# EAGLE design hw3s (EAGLE 8.6.0)
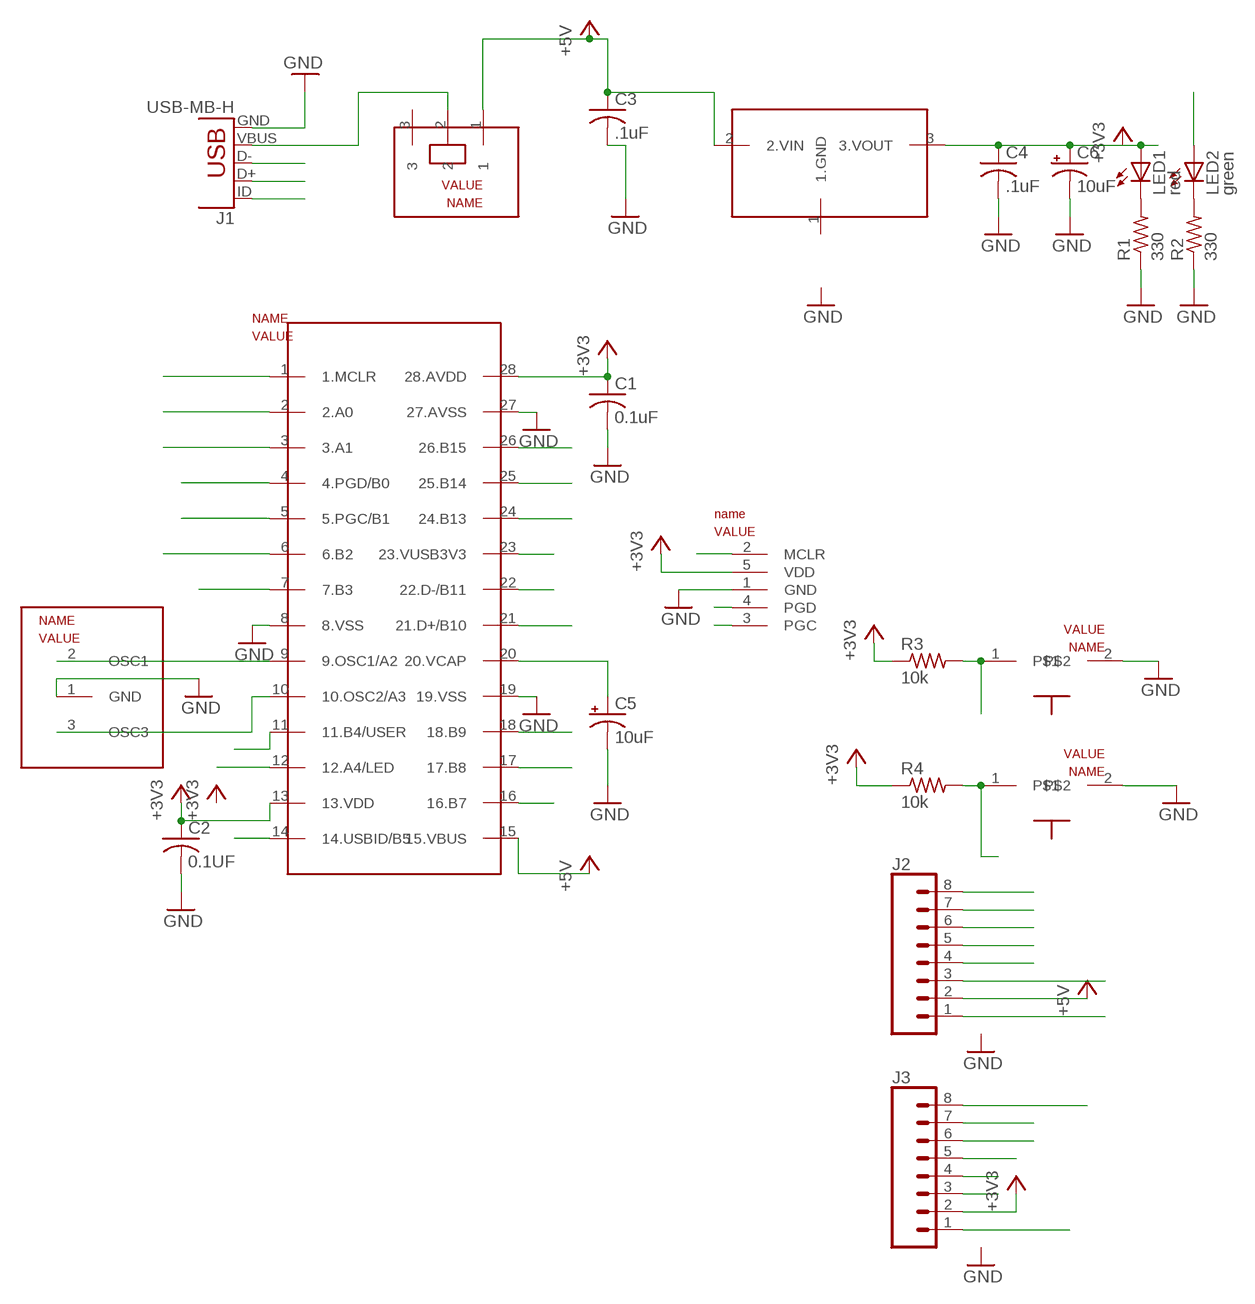
[diagram p0: schematic, sheet 1]

## Parts
C1  0.1uF  C-US025-025X050  [C025-025X050]
C2  0.1UF  C-US025-025X050  [C025-025X050]
C3  .1uF  C-US025-025X050  [C025-025X050]
C4  .1uF  C-US025-025X050  [C025-025X050]
C5  10uF  CPOL-USB45181B  [B45181B]
C6  10uF  CPOL-USB45181B  [B45181B]
J1  USB-MB-H  [USB-MB-H]
J2  CONN_08"  [1X08]
J3  CONN_08"  [1X08]
LED1  red  LED3MM  [LED3MM]
LED2  green  LED3MM  [LED3MM]
R1  330  R-US_0207/10  [0207/10]
R2  330  R-US_0207/10  [0207/10]
R3  10k  R-US_0207/10  [0207/10]
R4  10k  R-US_0207/10  [0207/10]
U$1  PIC32  [DIL28-3]
U$2  SLIDE  [SLIDE]
U$3  MCP1702  [TO92]
U$4  RESET  PB  [PB]
U$5  USER  PB  [PB]
U$6  PICKIT3  [1X05]
U$7  8MHZ  OSC  [OSC]

## Nets
+3V3: C1.1 C2.1 J3.2 R3.1 R4.1 U$1.13(13.VDD) U$1.28(28.AVDD) U$6.5(VDD)
+5V: C3.1 J2.2 U$1.15(15.VBUS) U$2.1 U$3.2(2.VIN)
A0: J3.8 U$1.2(2.A0)
A1: J3.7 U$1.3(3.A1)
A4/LED: J3.3 LED2.A U$1.12(12.A4/LED)
B2: J3.6 U$1.6(6.B2)
B3: J3.5 U$1.7(7.B3)
B4/USER: J3.4 R4.2 U$1.11(11.B4/USER) U$5.1
B7: J2.3 U$1.16(16.B7)
B8: J2.4 U$1.17(17.B8)
B9: J2.5 U$1.18(18.B9)
B13: J2.6 U$1.24(24.B13)
B14: J2.7 U$1.25(25.B14)
B15: J2.8 U$1.26(26.B15)
B+/B10: J1.D+
D+/B10: U$1.21(21.D+/B10)
D-/B11: J1.D- U$1.22(22.D-/B11)
GND: C1.2 C2.2 C3.2 C4.2 C5.- C6.- J1.GND R1.1 R2.1 U$1.8(8.VSS) U$1.19(19.VSS) U$1.27(27.AVSS) U$4.2 U$5.2 U$6.1(GND) U$7.1(GND)
MCLR: R3.2 U$1.1(1.MCLR) U$4.1 U$6.2(MCLR)
N$1: J1.VBUS U$2.2
N$2: U$1.9(9.OSC1/A2) U$7.2(OSC1)
N$3: C4.1 C6.+ LED1.A U$3.3(3.VOUT)
N$4: LED1.K(C) R1.2
N$5: LED2.K(C) R2.2
N$6: U$1.10(10.OSC2/A3) U$7.3(OSC3)
N$7: C5.+ U$1.20(20.VCAP)
N$16: J2.1
N$23: J3.1
PGC/B1: U$1.5(5.PGC/B1) U$6.3(PGC)
PGD/B0: U$1.4(4.PGD/B0) U$6.4(PGD)
USBID/B5: J1.ID U$1.14(14.USBID/B5)
VUSB3V3: U$1.23(23.VUSB3V3)
Unconnected: U$2.3 U$3.1(1.GND)

## Library data of the parts
C1-C4 = hw3lib:C-US: CAPACITOR, American symbol
C5 C6 = hw3lib:CPOL-US: POLARIZED CAPACITOR, American symbol
J1 = hw3lib:USB: USB Connectors USB-B-PTH is fully proven SKU : PRT-00139/CONN-08278 USB-miniB is fully proven SKU : PRT-00587 USB-A-PCB is untested. USB-A-H is throughly reviewed, but untested. Spark Fun Electronics SKU : PRT-00437 USB-B-SMT is throughly reviewed, but untested. Needs silkscreen touching up. USB-A-S has not been used/tested USB-MB-H has not been used/tested USB-MICROB has been used. CONN-09505
J2 J3 = hw3lib:CONN_08: Multi connection point. Often used as Generic Header-pin footprint for 0.1 inch spaced/style header connections On any of the 0.1 inch spaced packages, you can populate with these: Break Away Headers - Straight <https://www.sparkfun.com/products/116> (PRT-00116) Break Away Male Headers - Right Angle <https://www.sparkfun.com/products/553> (PRT-00553) Female Headers <https://www.sparkfun.com/products/115> (PRT-00115) Break Away Headers - Machine Pin <https://www.sparkfun.com/products/117> (PRT-00117) Break Away Female Headers - Swiss Machine Pin <https://www.sparkfun.com/products/743> (PRT-00743) Arduino Stackable Header - 8 Pin <https://www.sparkfun.com/products/9279> (PRT-09279) For SCREWTERMINALS and SPRING TERMINALS visit here: Screw Terimnals on SparkFun.com <https://www.sparkfun.com/search/results?term=Screw+Terminals> (5mm/3.5mm/2.54mm spacing) This device is also useful as a general connection point to wire up your design to another part of your project. Our various solder wires solder well into these plated through hole pads. Hook-Up Wire - Assortment (Stranded, 22 AWG) <https://www.sparkfun.com/products/11375> (PRT-11375) Hook-Up Wire - Assortment (Solid Core, 22 AWG) <https://www.sparkfun.com/products/11367> (PRT-11367) View the entire wire category on our website here <https://www.sparkfun.com/categories/141> Special notes: Molex polarized connector foot print use with SKU : PRT-08231 with associated crimp pins and housings. 1MM SMD Version SKU: PRT-10208 NOTES ON THE VARIANTS LOCK and LOCK_LONGPADS... This footprint was designed to help hold the alignment of a through-hole component (i.e. 6-pin header) while soldering it into place. You may notice that each hole has been shifted either up or down by 0.005 of an inch from it's more standard position (which is a perfectly straight line). This slight alteration caused the pins (the squares in the middle) to touch the edges of the holes. Because they are alternating, it causes a "brace" to hold the component in place. 0.005 has proven to be the perfect amount of "off-center" position when using our standard breakaway headers. Although looks a little odd when you look at the bare footprint, once you have a header in there, the alteration is very hard to notice. Also,if you push a header all the way into place, it is covered up entirely on the bottom side.; PROD_ID: CONN-08438
LED1 LED2 = led:LED: LED OSRAM: - CHIPLED LG R971, LG N971, LY N971, LG Q971, LY Q971, LO R971, LY R971 LH N974, LH R974 LS Q976, LO Q976, LY Q976 LO Q996 - Hyper CHIPLED LW Q18S LB Q993, LB Q99A, LB R99A - SideLED LS A670, LO A670, LY A670, LG A670, LP A670 LB A673, LV A673, LT A673, LW A673 LH A674 LY A675 LS A676, LA A676, LO A676, LY A676, LW A676 LS A679, LY A679, LG A679 - Hyper Micro SIDELED® LS Y876, LA Y876, LO Y876, LY Y876 LT Y87S - SmartLED LW L88C, LW L88S LB L89C, LB L89S, LG L890 LS L89K, LO L89K, LY L89K LS L896, LA L896, LO L896, LY L896 - TOPLED LS T670, LO T670, LY T670, LG T670, LP T670 LSG T670, LSP T670, LSY T670, LOP T670, LYG T670 LG T671, LOG T671, LSG T671 LB T673, LV T673, LT T673, LW T673 LH T674 LS T676, LA T676, LO T676, LY T676, LB T676, LH T676, LSB T676, LW T676 LB T67C, LV T67C, LT T67C, LS T67K, LO T67K, LY T67K, LW E67C LS E67B, LA E67B, LO E67B, LY E67B, LB E67C, LV E67C, LT E67C LW T67C LS T679, LY T679, LG T679 LS T770, LO T770, LY T770, LG T770, LP T770 LB T773, LV T773, LT T773, LW T773 LH T774 LS E675, LA E675, LY E675, LS T675 LS T776, LA T776, LO T776, LY T776, LB T776 LHGB T686 LT T68C, LB T68C - Hyper Mini TOPLED® LB M676 - Mini TOPLED Santana® LG M470 LS M47K, LO M47K, LY M47K Source: http://www.osram.convergy.de LUXEON: - LUMILED® LXK2-PW12-R00, LXK2-PW12-S00, LXK2-PW14-U00, LXK2-PW14-V00 LXK2-PM12-R00, LXK2-PM12-S00, LXK2-PM14-U00 LXK2-PE12-Q00, LXK2-PE12-R00, LXK2-PE12-S00, LXK2-PE14-T00, LXK2-PE14-U00 LXK2-PB12-K00, LXK2-PB12-L00, LXK2-PB12-M00, LXK2-PB14-N00, LXK2-PB14-P00, LXK2-PB14-Q00 LXK2-PR12-L00, LXK2-PR12-M00, LXK2-PR14-Q00, LXK2-PR14-R00 LXK2-PD12-Q00, LXK2-PD12-R00, LXK2-PD12-S00 LXK2-PH12-R00, LXK2-PH12-S00 LXK2-PL12-P00, LXK2-PL12-Q00, LXK2-PL12-R00 Source: www.luxeon.com KINGBRIGHT: KA-3528ASYC Source: www.kingbright.com
R1-R4 = hw3lib:R-US_: RESISTOR, American symbol
U$1 = hw3lib:PIC32
U$2 = hw3lib:SLIDE
U$3 = hw3lib:MCP1702
U$4 U$5 = hw3lib:PB
U$6 = hw3lib:PICKIT3
U$7 = hw3lib:OSC

## Board
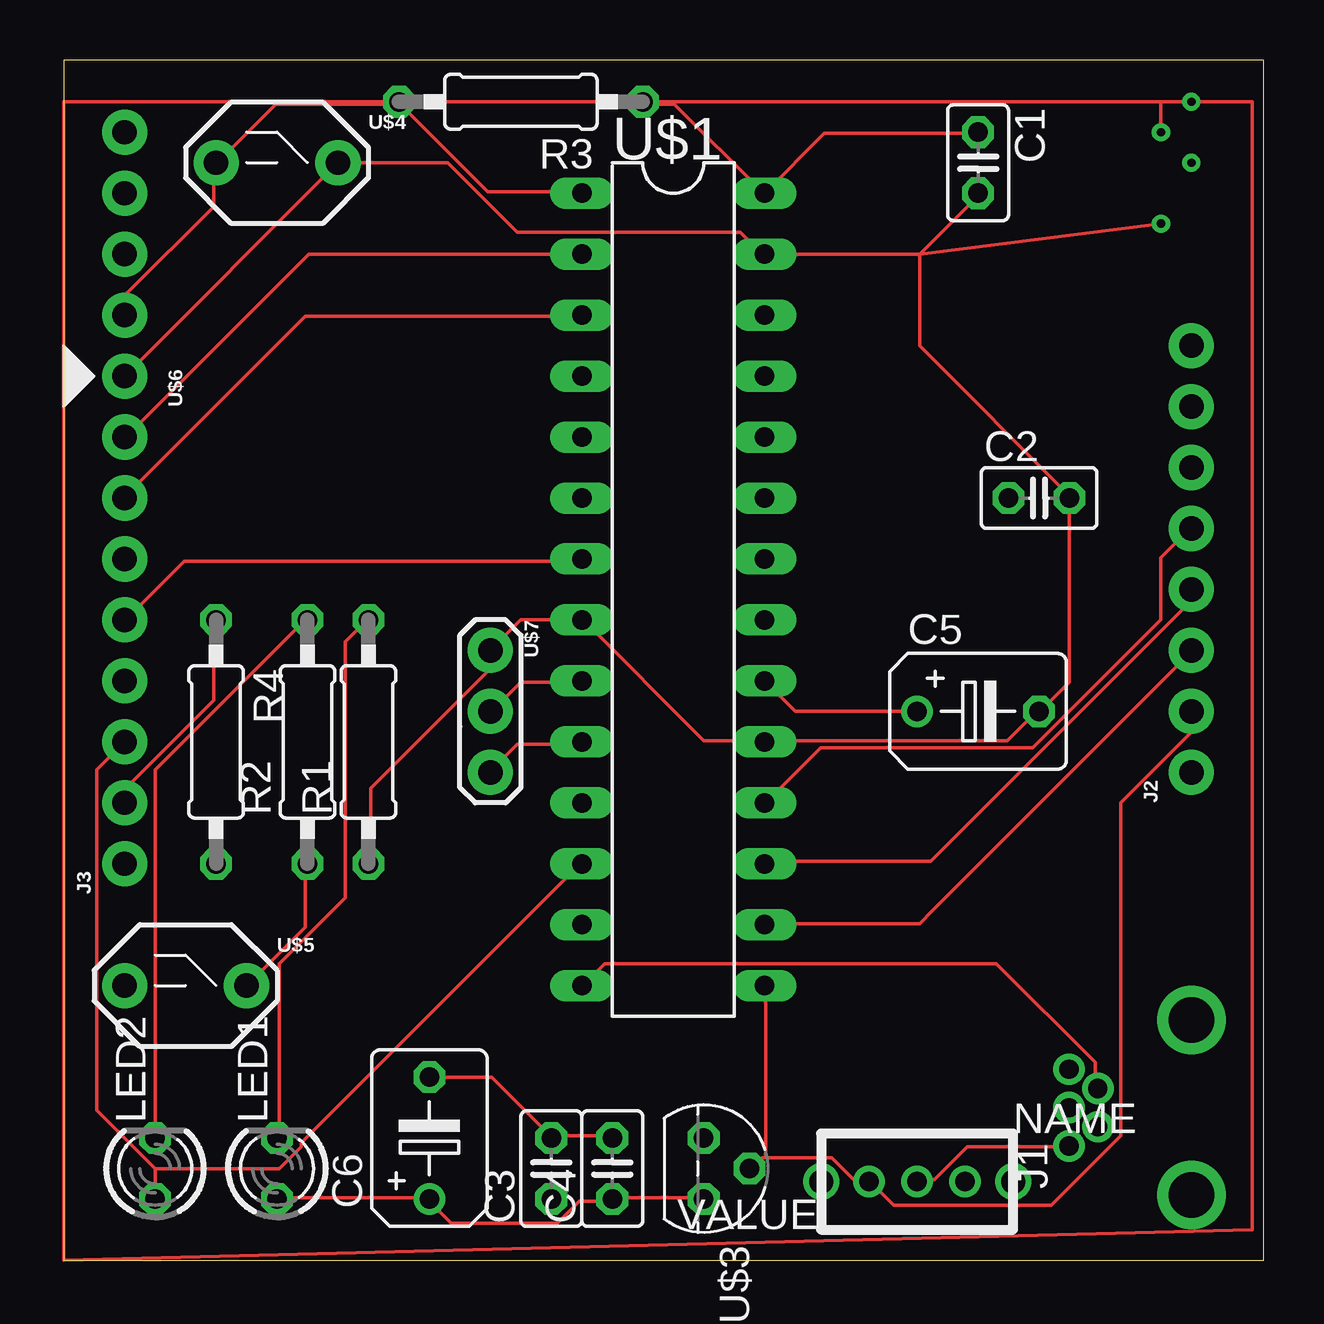
[diagram p1: board, top side]
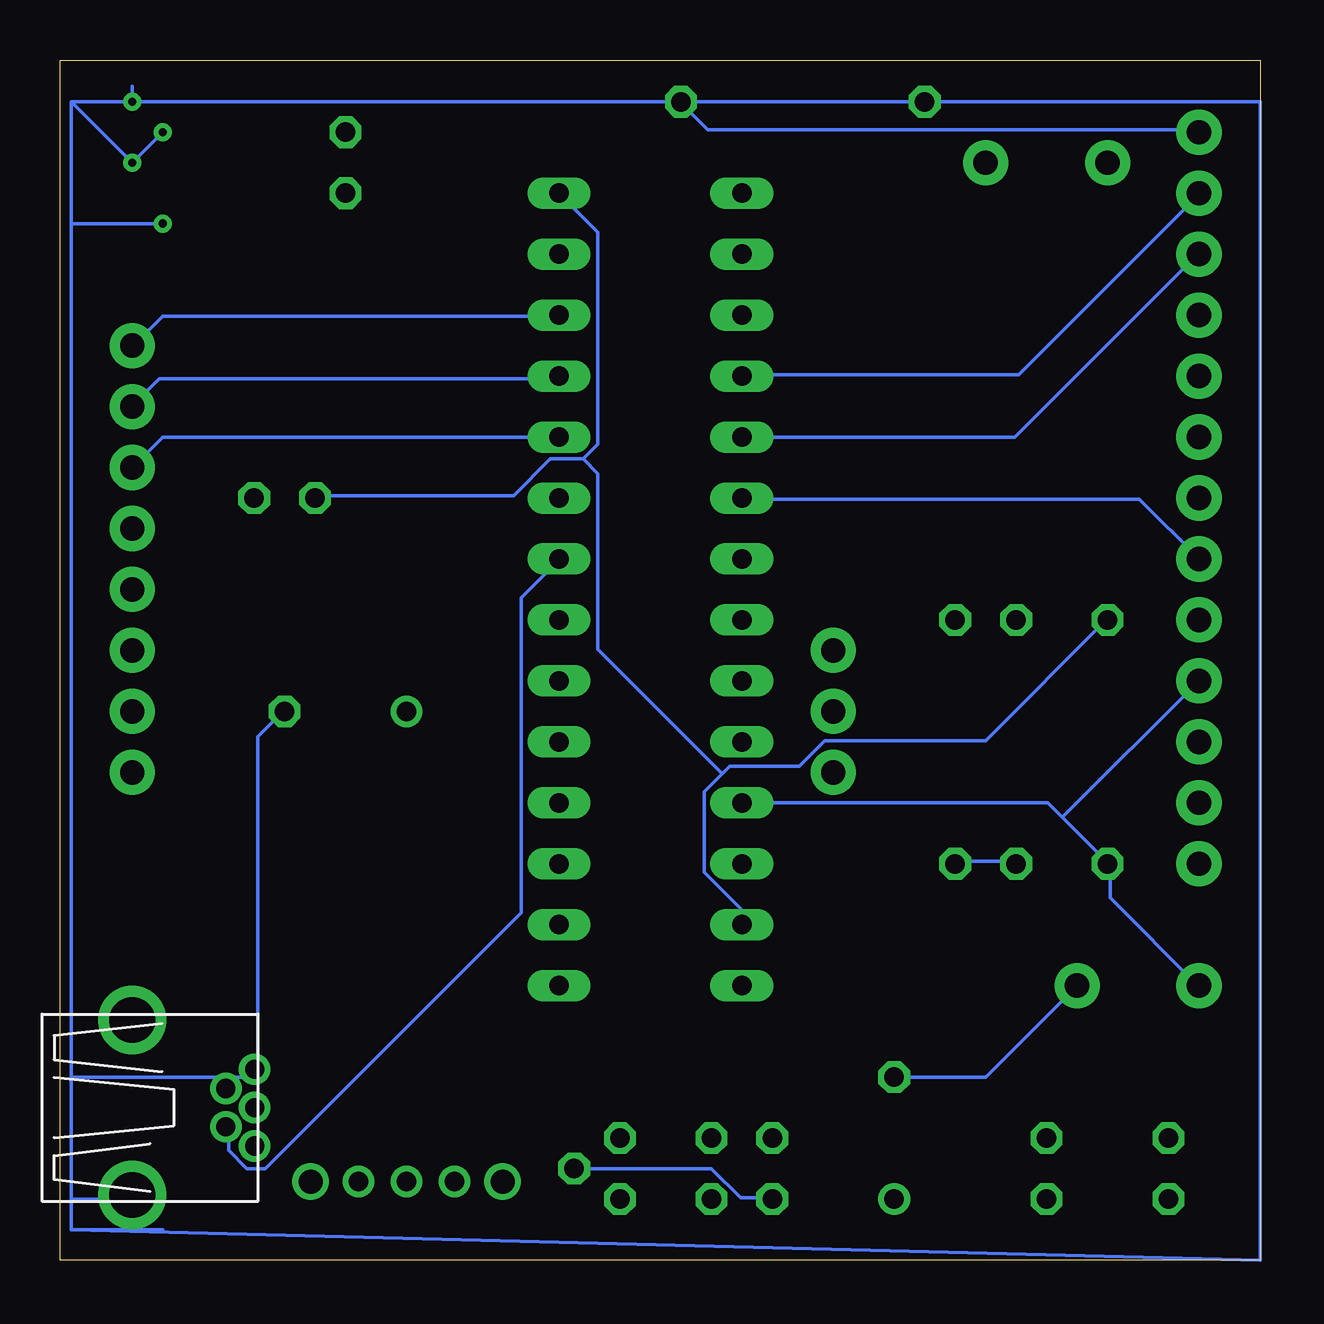
[diagram p2: board, bottom side, seen from below]

Size 50 x 50 mm. Coordinates in mm from the lower left corner, seen from the top.
Outline: 0,0 50,0 50,50 0,50 0,0
Copper layers (1*16): Top 0.035mm / dielectric 1.5mm / Bottom 0.035mm
Design rules "default": minimum track width 6mil, minimum drill 0.35mm, track to track 6mil, track to pad 6mil, pad to pad 6mil, via to via 6mil, smd to smd 6mil, copper to edge 40mil, drill to drill 6mil, minimum pad ring 10mil, minimum via ring 8mil, stop-mask expansion 4mil, vias tented up to drill 0mil, thermal gap 10mil

### Footprints (pad centres in the part's own frame; a part is rotated, then mirrored left to right if it is on the bottom)
C025-025X050 = drill 0.813 octagon: 1 -1.27,0; 2 1.27,0
B45181B = drill 0.813: + -2.54,0 | drill 0.813 octagon: - 2.54,0
USB-MB-H = drill 0.8: D+ 5.1,0; D- 3.9,0.8; GND 5.1,-1.6; ID 3.9,-0.8; VBUS 5.1,1.6 | drill 1.9: P$6 0,-3.65; P$7 0,3.65
1X08 = drill 1.016 pad 1.88: 1 0,0; 2 2.54,0; 3 5.08,0; 4 7.62,0; 5 10.16,0; 6 12.7,0; 7 15.24,0; 8 17.78,0
LED3MM = drill 0.813 octagon: A -1.27,0; K 1.27,0
0207/10 = drill 0.813 octagon: 1 -5.08,0; 2 5.08,0
DIL28-3 = drill 0.813 long: 1 -16.51,-3.81; 2 -13.97,-3.81; 3 -11.43,-3.81; 4 -8.89,-3.81; 5 -6.35,-3.81; 6 -3.81,-3.81; 7 -1.27,-3.81; 8 1.27,-3.81; 9 3.81,-3.81; 10 6.35,-3.81; 11 8.89,-3.81; 12 11.43,-3.81; 13 13.97,-3.81; 14 16.51,-3.81; 15 16.51,3.81; 16 13.97,3.81; 17 11.43,3.81; 18 8.89,3.81; 19 6.35,3.81; 20 3.81,3.81; 21 1.27,3.81; 22 -1.27,3.81; 23 -3.81,3.81; 24 -6.35,3.81; 25 -8.89,3.81; 26 -11.43,3.81; 27 -13.97,3.81; 28 -16.51,3.81
SLIDE = drill 0.8: 1 -2,2; 2 0,2; 3 2,2 | drill 1: P$1 -4,2; P$5 4,2
TO92 = drill 0.813 octagon: 1 -1.27,0; 2 0,1.905; 3 1.27,0
PB = drill 1.016 pad 1.88: 1 -1.27,0; 2 3.81,0
1X05 = drill 1.016 pad 1.88: 1 0,0; 2 2.54,0; 3 5.08,0; 4 7.62,0; 5 10.16,0
OSC = drill 1.016 pad 1.88: 1 -2.54,-2.54; 2 0,-2.54; 3 2.54,-2.54

### Placement (x,y rotation side)
C1  38.1,45.72 270 top
C2  40.64,31.75 0 top
C3  20.32,3.81 90 top
C4  22.86,3.81 90 top
C5  38.1,22.86 0 top
C6  15.24,5.08 90 top
J1  46.99,6.35 180 top
J2  46.99,20.32 90 top
J3  2.54,16.51 90 top
LED1  8.89,3.81 90 top
LED2  3.81,3.81 90 top
R1  12.7,21.59 90 top
R2  10.16,21.59 90 top
R3  19.05,48.26 180 top
R4  6.35,21.59 270 top
U$1  25.4,27.94 270 top
U$2  35.56,1.27 0 top
U$3  26.67,3.81 270 top
U$4  7.62,45.72 0 top
U$5  3.81,11.43 0 top
U$6  2.54,36.83 90 top
U$7  20.32,22.86 270 top

### Tracks (layer width: path | path; a pad name or v marks a point on that pad's centre or on a via)
+3V3
  Top 0.152: R4.1 6.25,26.67 6.25,23.32 2.59,19.66 2.59,19.05 J3.2 | R3.1 24.23,48.16 25.45,48.16 29.11,44.5 U$1.28 31.7,46.94 38.1,46.94 C1.1
  Bottom 0.152: 22.4,20.27 22.1,20.57 19.2,20.57 18.14,21.64 11.43,21.64 6.4,26.67 R4.1 | 22.4,20.27 23.16,19.51 23.16,16.15 21.64,14.63 21.64,14.02 U$1.13 | 28.19,33.38 29.57,33.38 31.09,31.85 39.32,31.85 C2.1 | 28.19,33.38 27.58,33.98 27.58,42.82 U$1.28 | U$6.5 2.59,47.09 23.01,47.09 24.08,48.16 R3.1 | 22.4,20.27 27.58,25.45 27.58,32.77 28.19,33.38
+5V
  Top 0.152: 29.26,4.27 29.11,4.27 28.65,3.81 U$3.2 | 29.26,4.27 32,4.27 32.92,3.35 33.53,3.35 U$2.1 33.68,3.2 34.59,2.29 41.15,2.29 44.04,5.18 44.04,19.05 46.94,21.95 46.94,22.86 J2.2 | 29.26,4.27 29.26,11.43 U$1.15
  Bottom 0.152: U$3.2 22.86,3.81 21.64,2.59 20.42,2.59 C3.1
A0
  Top 0.152: U$1.2 10.21,41.91 2.59,34.29 J3.8
A1
  Top 0.152: U$1.3 21.49,39.32 10.06,39.32 2.59,31.85 J3.7
A4/LED
  Top 0.152: 3.81,3.81 LED2.A | 3.81,3.81 1.37,6.25 1.37,20.42 J3.3 | 3.81,3.81 8.99,3.81 9.91,4.72 9.91,4.88 21.49,16.46 U$1.12
B2
  Bottom 0.152: J3.6 5.03,31.7 21.49,31.7 U$1.6
B3
  Top 0.152: U$1.7 21.49,29.11 5.03,29.11 2.59,26.67 J3.5
B4/USER
  Bottom 0.152: U$5.1 2.59,11.43 6.25,15.09 6.25,16.46 R4.2 6.4,16.61 8.23,18.44 | U$1.11 8.84,19.05 8.23,18.44 | 8.23,18.44 J3.4
B7
  Top 0.152: U$1.16 29.26,14.02 35.66,14.02 36.22,14.58 46.94,25.3 J2.3
B8
  Top 0.152: U$1.17 29.26,16.61 36.12,16.61 46.94,27.43 46.94,27.89 J2.4
B9
  Top 0.152: U$1.18 29.26,19.05 31.55,21.34 40.39,21.34 45.72,26.67 45.72,29.26 46.94,30.48 J2.5
B13
  Bottom 0.152: U$1.24 45.72,34.29 J2.6
B14
  Bottom 0.152: U$1.25 29.26,36.73 45.87,36.73 46.94,35.66 J2.7
B15
  Bottom 0.152: U$1.26 29.26,39.32 45.72,39.32 46.94,38.1 J2.8
D-/B11
  Bottom 0.152: J1.D- 42.98,5.49 42.98,4.57 42.22,3.81 41.45,3.81 30.79,14.48 30.79,27.58 29.26,29.11 U$1.22
GND  (via drill 0.35)
  Top 0.152: 45.72,48.26 v46.99,48.26 49.53,48.26 49.53,1.27 0,0 0,48.26 45.72,48.26 | C4.2 22.86,5.18 20.42,5.18 C3.2 20.27,5.18 17.83,7.62 C6.- | U$5.2 10.06,13.87 10.06,16.46 R2.1 | R1.1 12.8,16.61 12.8,19.66 17.68,24.54 17.68,25.3 U$7.1 19.05,26.67 U$1.8 21.64,26.67 26.67,21.64 29.11,21.64 U$1.19 29.26,21.64 39.32,21.64 40.54,22.86 C5.- 40.69,22.86 41.91,24.08 C2.2 41.91,31.85 35.66,38.1 35.66,41.91 | U$6.1 U$4.2 16,45.72 18.9,42.82 28.19,42.82 29.11,41.91 U$1.27 35.66,41.91 | 35.66,41.91 38.1,44.35 C1.2 | v45.72,43.18 35.66,41.91 | v45.72,46.99 45.72,48.26
  Bottom 0.152: 49.53,1.27 0,0 0,48.26 49.53,48.26 | 49.53,7.62 49.53,43.18 | 49.53,43.18 49.53,48.26 | R2.1 10.21,16.61 12.65,16.61 R1.1 | C6.- 11.43,7.62 U$5.2 | J1.GND 41.76,8.08 41.76,21.79 40.69,22.86 C5.- | 45.72,1.27 49.53,1.27 | 49.53,1.27 49.53,2.54 | 49.53,2.54 49.53,7.62 | 49.53,7.62 41.91,7.62 | 48.26,2.54 49.53,2.54 | 49.53,43.18 v45.72,43.18 | v46.99,48.26 46.99,48.91 | 49.53,48.26 v46.99,45.72 v45.72,46.99
MCLR
  Top 0.152: U$1.1 21.49,44.5 17.68,44.5 14.02,48.16 R3.2 13.87,48.16 8.84,48.16 6.4,45.72 U$4.1 6.25,45.72 6.25,43.89 2.59,40.23 2.59,39.47 U$6.2
N$1
  Top 0.152: U$2.2 35.66,3.35 36.27,3.35 37.64,4.72 41.76,4.72 J1.VBUS
N$2
  Top 0.152: U$1.9 21.49,24.08 19.05,24.08 17.83,22.86 U$7.2
N$3
  Top 0.152: U$3.3 26.67,2.59 22.86,2.59 C4.1 22.86,2.44 21.49,2.44 20.57,1.52 16.15,1.52 15.24,2.44 C6.+ 15.24,2.59 8.99,2.59 LED1.A
N$4
  Top 0.152: LED1.K 8.99,5.18 8.99,12.34 11.73,15.09 11.73,25.76 12.65,26.67 R1.2
N$5
  Top 0.152: LED2.K 3.81,20.42 10.06,26.67 R2.2
N$6
  Top 0.152: U$1.10 21.49,21.49 18.9,21.49 17.83,20.42 U$7.3
N$7
  Top 0.152: C5.+ 30.48,22.86 U$1.20
PGC/B1
  Bottom 0.152: U$1.5 10.21,34.29 2.59,41.91 U$6.3
PGD/B0
  Bottom 0.152: U$1.4 21.49,36.88 10.06,36.88 2.59,44.35 U$6.4
USBID/B5
  Top 0.152: J1.ID 42.98,7.16 42.98,8.23 38.86,12.34 22.55,12.34 21.64,11.43 U$1.14